# Altium schematic sheet IntegratedConnectors.SchDoc: Science - 5_Integrated-Connectors
size Letter; DrawnBy: Wolfgang Windholtz; Organization: UW Robotics; Address1: 200 University Avenue; Address2: Waterloo; Address3: Ontario; Address4: Canada N2L 3G6; SheetNumber: 5; SheetTotal: 6
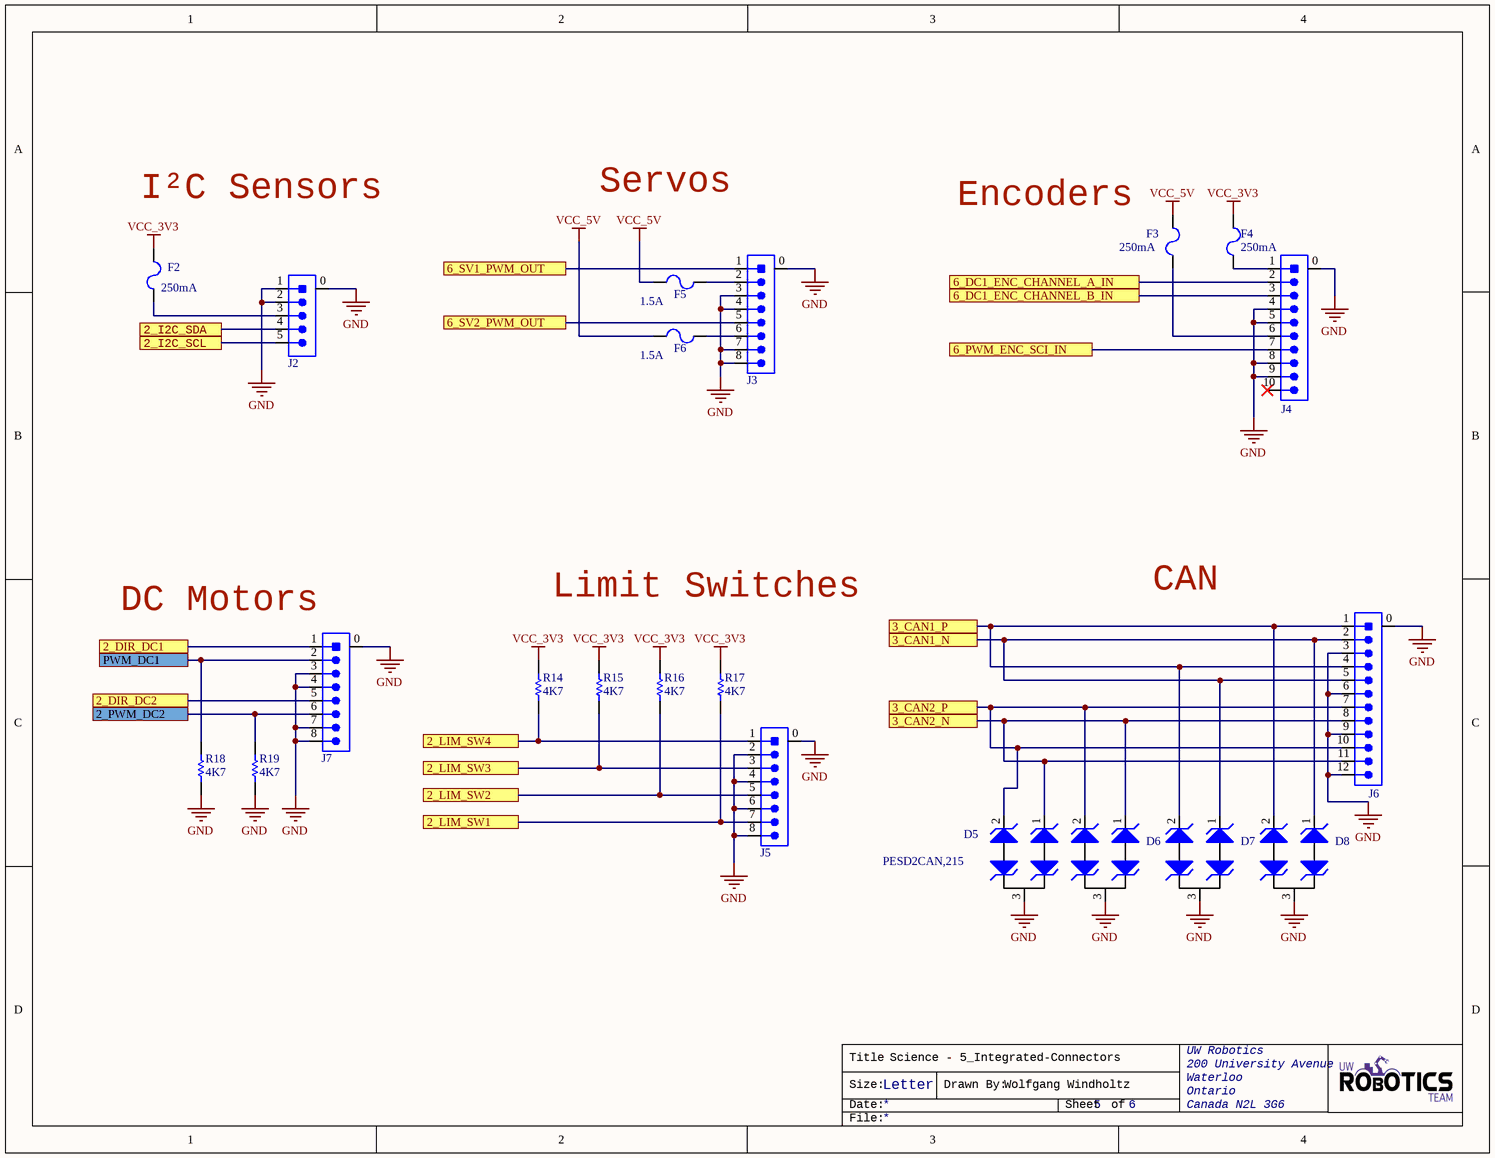
[diagram p0: IntegratedConnectors.SchDoc]

## Parts
D5  Manufacturer Part Number: PESD2CAN,215  [TVS_DIODE_CAN]  (hidden comment: TVS_DIODE_CAN)
D6  TVS_DIODE_CAN  [TVS_DIODE_CAN]  (value not drawn)
D7  TVS_DIODE_CAN  [TVS_DIODE_CAN]  (value not drawn)
D8  TVS_DIODE_CAN  [TVS_DIODE_CAN]  (value not drawn)
F2  Current Rating: 250mA  [FUSE_0603]  (hidden comment: FUSE_250mA_0603)
F3  Current Rating: 250mA  [FUSE_0603]  (hidden comment: FUSE_250mA_0603)
F4  Current Rating: 250mA  [FUSE_0603]  (hidden comment: FUSE_250mA_0603)
F5  Current Rating: 1.5A  [FUSE_0603]  (hidden comment: FUSE_1.5A_0603)
F6  Current Rating: 1.5A  [FUSE_0603]  (hidden comment: FUSE_1.5A_0603)
J2  CON_5M_SM_VERT  [MOLEX-5025840570]  (value not drawn)
J3  CON_8M_SM_RA  [MOLEX-5025850870]  (value not drawn)
J4  (no value)  [MOLEX-5025851070]
J5  CON_8M_SM_RA  [MOLEX-5025850870]  (value not drawn)
J6  (no value)  [MOLEX-5025851270]
J7  CON_8M_SM_RA  [MOLEX-5025850870]  (value not drawn)
R14  value 4K7  [RESC0603(1608)_N]  (hidden comment: RES_4K7_0603)
R15  value 4K7  [RESC0603(1608)_N]  (hidden comment: RES_4K7_0603)
R16  value 4K7  [RESC0603(1608)_N]  (hidden comment: RES_4K7_0603)
R17  value 4K7  [RESC0603(1608)_N]  (hidden comment: RES_4K7_0603)
R18  value 4K7  [RESC0603(1608)_N]  (hidden comment: RES_4K7_0603)
R19  value 4K7  [RESC0603(1608)_N]  (hidden comment: RES_4K7_0603)

## Ports
2_DIR_DC1, 2_DIR_DC2, 2_I2C_SCL, 2_I2C_SDA, 2_LIM_SW1, 2_LIM_SW2, 2_LIM_SW3, 2_LIM_SW4, 2_PWM_DC2, 3_CAN1_N, 3_CAN1_P, 3_CAN2_N, 3_CAN2_P, 6_DC1_ENC_CHANNEL_A_IN, 6_DC1_ENC_CHANNEL_B_IN, 6_PWM_ENC_SCI_IN, 6_SV1_PWM_OUT, 6_SV2_PWM_OUT, PWM_DC1

## Nets
GND: D5.3 D6.3 D7.3 D8.3 J2.0 J2.1 J2.2 J3.0 J3.3 J3.4 J3.7 J3.8 J4.0 J4.4 J4.5 J4.8 J4.9 J5.0 J5.2 J5.4 J5.6 J5.8 J6.0 J6.3 J6.6 J6.9 J6.12 J7.0 J7.3 J7.4 J7.7 J7.8 R18.2 R19.2
VCC_3V3: F2.1 F4.2 R14.2 R15.2 R16.2 R17.2
VCC_5V: F3.2 F5.2 F6.2
2_DIR_DC1: J7.1 ; port 2_DIR_DC1
2_DIR_DC2: J7.5 ; port 2_DIR_DC2
2_I2C_SCL: J2.5 ; port 2_I2C_SCL
2_I2C_SDA: J2.4 ; port 2_I2C_SDA
2_LIM_SW1: J5.7 R17.1 ; port 2_LIM_SW1
2_LIM_SW2: J5.5 R16.1 ; port 2_LIM_SW2
2_LIM_SW3: J5.3 R15.1 ; port 2_LIM_SW3
2_LIM_SW4: J5.1 R14.1 ; port 2_LIM_SW4
2_PWM_DC2: J7.6 R19.1 ; port 2_PWM_DC2
3_CAN1_N: D7.1 D8.1 J6.2 J6.5 ; port 3_CAN1_N
3_CAN1_P: D7.2 D8.2 J6.1 J6.4 ; port 3_CAN1_P
3_CAN2_N: D5.1 D6.1 J6.8 J6.11 ; port 3_CAN2_N
3_CAN2_P: D5.2 D6.2 J6.7 J6.10 ; port 3_CAN2_P
6_DC1_ENC_CHANNEL_A_IN: J4.2 ; port 6_DC1_ENC_CHANNEL_A_IN
6_DC1_ENC_CHANNEL_B_IN: J4.3 ; port 6_DC1_ENC_CHANNEL_B_IN
6_PWM_ENC_SCI_IN: J4.7 ; port 6_PWM_ENC_SCI_IN
6_SV1_PWM_OUT: J3.1 ; port 6_SV1_PWM_OUT
6_SV2_PWM_OUT: J3.5 ; port 6_SV2_PWM_OUT
PWM_DC1: J7.2 R18.1 ; port PWM_DC1
NetF2_2: F2.2 J2.3
NetF3_1: F3.1 J4.6
NetF4_1: F4.1 J4.1
NetF5_1: F5.1 J3.2
NetF6_1: F6.1 J3.6

Not connected (* = marked no-connect by the designer): J4 10*

## Notes on the sheet
- I²C Sensors
- Servos
- Encoders
- (near J7) DC Motors
- Limit Switches
- CAN
- Title
- Size:
- Date:
- Letter
- Drawn By:
- Sheet
- of
- File:

## Library data of the parts
D5-D8 = TVS_DIODE_CAN: TVS DIODE 24V 41V SOT323-3; Manufacturer: Nexperia USA Inc.; Package: SC-70, SOT-323; ComponentLink1Description: Datasheet; ComponentLink1URL: https://assets.nexperia.com/documents/data-sheet/PESD1CAN-U.pdf; Supplier Part Number 1: 1727-3891-1-ND; Supplier 1: Digi-Key
F2-F4 = FUSE_250mA_0603: FUSE SMD 250mA 32V; ComponentLink1URL: https://datasheet.ciiva.com/303/467-303396.pdf?src-supplier=Digi-Key; ComponentLink1Description: https://datasheet.ciiva.com/303/467-303396.pdf?src-supplier=Digi-Key; ComponentLink2URL: https://datasheet.ciiva.com/18652/littelfuse-fuse-467-datasheet-pdf-18652490.pdf?src-supplier=Digi-Key; ComponentLink2Description: https://datasheet.ciiva.com/18652/littelfuse-fuse-467-datasheet-pdf-18652490.pdf?src-supplier=Digi-Key; ComponentLink3URL: https://datasheet.ciiva.com/18652/littelfuse-fuse-467-datasheet-pdf-18652491.pdf?src-supplier=Digi-Key; ComponentLink3Description: https://datasheet.ciiva.com/18652/littelfuse-fuse-467-datasheet-pdf-18652491.pdf?src-supplier=Digi-Key; ComponentLink4URL: https://datasheet.ciiva.com/18652/littelfuse-fuse-467-datasheet-pdf-18652492.pdf?src-supplier=Digi-Key; ComponentLink4Description: https://datasheet.ciiva.com/18652/littelfuse-fuse-467-datasheet-pdf-18652492.pdf?src-supplier=Digi-Key; Voltage Rating (AC): 32V; Voltage Rating (DC): 32V; Supplier 1: Digi-Key; Supplier Part Number 1: F6020CT-ND; Supplier Packaging 1: Cut Tape; Mount: Surface Mount
F5 F6 = FUSE_1.5A_0603: FUSE SMD 1.5A 32V; ComponentLink1URL: https://datasheet.ciiva.com/26890/getdatasheetpartid-721713-26890390.pdf?src-supplier=Verical; ComponentLink1Description: https://datasheet.ciiva.com/26890/getdatasheetpartid-721713-26890390.pdf?src-supplier=Verical; ComponentLink2URL: https://datasheet.ciiva.com/7464/467-7464069.pdf?src-supplier=Digi-Key; ComponentLink2Description: https://datasheet.ciiva.com/7464/467-7464069.pdf?src-supplier=Digi-Key; ComponentLink3URL: https://datasheet.ciiva.com/7464/467-7464072.pdf?src-supplier=Digi-Key; ComponentLink3Description: https://datasheet.ciiva.com/7464/467-7464072.pdf?src-supplier=Digi-Key; Mount: Surface Mount; Voltage Rating (AC): 32V; Voltage Rating (DC): 32V; Supplier 1: Digi-Key; Supplier Part Number 1: F5702CT-ND; Supplier Packaging 1: Cut Tape
J2 = CON_5M_SM_VERT: CONN HEADER SMD VERTICAL 1.5MM PITCH; Manufacturer 1: Molex; Manufacturer Part Number 1: 5025840570; Connector Type: Receptacle,Center Strip Contact; Number of Positions: 5; Gender: Female; Current Rating: 2A; Voltage Rating: 100V; Glow Wire Compliant: Non-compliant; Supplier 1: Digi-Key; Stock 1: 2875; Pricing 1: 1=0.66000, 10=0.61400, 100=0.47110 (USD); RoHS: Yes; Mount: Surface Mount; Housing Material: Resin; Housing Color: Beige; Contact Plating: Tin; Color: Beige; Contact Material: Copper Alloy; Min Operating Temperature: -25°C; Max Operating Temperature: 85°C; Termination: Solder; Number of Contacts: 5; Orientation: Vertical; Number of Circuits: 5; Number of Rows: 1; Package Quantity: 900; Fastening Type: Latch; Packaging: Tape and Reel; Contact Gender: Female; Length: 11.8mm; Pitch: 1.5mm; Depth: 6.35mm; Radiation Hardening: No; REACH SVHC: No SVHC; ComponentLink1URL: https://datasheet.ciiva.com/756/5025840370-sd-756789.pdf?src-supplier=Digi-Key; ComponentLink1Description: https://datasheet.ciiva.com/756/5025840370-sd-756789.pdf?src-supplier=Digi-Key; ComponentLink2URL: https://datasheet.ciiva.com/30117/81825025840570-pcb-receptacles-30117024.pdf?src-supplier=Onlinecomponents.com; ComponentLink2Description: https://datasheet.ciiva.com/30117/81825025840570-pcb-receptacles-30117024.pdf?src-supplier=Onlinecomponents.com; ComponentLink3URL: https://datasheet.ciiva.com/10084/5025840570-pcb-receptacles-10084838.pdf?src-supplier=Avnet; ComponentLink3Description: https://datasheet.ciiva.com/10084/5025840570-pcb-receptacles-10084838.pdf?src-supplier=Avnet; ComponentLink4URL: https://datasheet.ciiva.com/13669/5025840570-pcb-receptacles-179570-13669898.pdf?src-supplier=Mouser; ComponentLink4Description: https://datasheet.ciiva.com/13669/5025840570-pcb-receptacles-179570-13669898.pdf?src-supplier=Mouser; Supplier Part Number 1: WM14463CT-ND
J3 J5 J7 = CON_8M_SM_RA: CONN HEADER SMD RIGHT ANGLE 1.5 MM PITCH; Manufacturer: Molex; Manufacturer Part Number: 5025850870; Current Rating: 2A; Voltage Rating: 100V; Contact Resistance: 20mR; Number of Positions: 8; Connector Type: Receptacle,Center Strip Contact; Gender: Receptacle; Pitch: 1.5mm; Glow Wire Compliant: Non-compliant; Supplier 1: Digi-Key; RoHS: Yes; Category: Headers and Wire Housings; Stock 1: 2293; Pricing 1: 1=0.73000, 10=0.64400, 100=0.55540, 500=0.45442 (USD); Mount: Surface Mount; Case/Package: SIL; Contact Plating: Tin; Contact Material: Copper,Copper Alloy,Tin; Color: Beige; Housing Color: Beige; Housing Material: Resin; Min Operating Temperature: -40°C; Max Operating Temperature: 85°C; Number of Rows: 1; Contact Gender: Female; Package Quantity: 1000; Packaging: Tape and Reel; Fastening Type: Latch; Orientation: Right Angle; Termination: Solder; Number of Contacts: 8; Number of Circuits: 8; Length: 16.3mm; Depth: 7.3mm; Radiation Hardening: No; REACH SVHC: Unknown; ComponentLink1URL: https://datasheet.ciiva.com/756/5025850370-sd-756815.pdf?src-supplier=Digi-Key; ComponentLink1Description: https://datasheet.ciiva.com/756/5025850370-sd-756815.pdf?src-supplier=Digi-Key; ComponentLink2URL: https://datasheet.ciiva.com/10085/5025850870-pcb-receptacles-10085216.pdf?src-supplier=Avnet; ComponentLink2Description: https://datasheet.ciiva.com/10085/5025850870-pcb-receptacles-10085216.pdf?src-supplier=Avnet; ComponentLink3URL: https://datasheet.ciiva.com/5149/5025850870-pcb-receptacles-230475-5149315.pdf?src-supplier=Mouser; ComponentLink3Description: https://datasheet.ciiva.com/5149/5025850870-pcb-receptacles-230475-5149315.pdf?src-supplier=Mouser; ComponentLink4URL: https://datasheet.ciiva.com/14804/368295025850870-pcb-receptacles-14804879.pdf?src-supplier=Arrow; ComponentLink4Description: https://datasheet.ciiva.com/14804/368295025850870-pcb-receptacles-14804879.pdf?src-supplier=Arrow; ComponentLink5URL: https://datasheet.ciiva.com/16736/5025850870-pcb-receptacles-16736807.pdf?src-supplier=Avnet+Europe; ComponentLink5Description: https://datasheet.ciiva.com/16736/5025850870-pcb-receptacles-16736807.pdf?src-supplier=Avnet+Europe; ComponentLink6URL: https://datasheet.ciiva.com/9468/5025850870-pcb-receptacles-9468074.pdf?src-supplier=Avnet; ComponentLink6Description: https://datasheet.ciiva.com/9468/5025850870-pcb-receptacles-9468074.pdf?src-supplier=Avnet; Supplier Part Number 1: WM14471CT-ND
J4 = CON_10M_SM_RA: CONN HEADER SMD RIGHT ANGLE 1.5 MM PITCH; Supplier 1: Digi-Key; Supplier Part Number 1: WM14472CT-ND
J6 = CON_12M_SM_RA: CONN HEADER SMD RIGHT ANGLE 1.5MM PITCH; Supplier 1: Digi-Key
R14-R19 = RES_4K7_0603: RES SMD 4.7K OHM 5% 1/10W 0603; Manufacturer: Yageo; MPN: RC0603JR-074K7L; Package: 0603 (1608 Metric); Dimensions: 0.063" L x 0.031" W (1.60mm x 0.80mm); Tolerance: 5%; Supplier Part Number 1: 311-4.7KGRCT-ND; Supplier 1: Digi-Key